# EAGLE design ometer (EAGLE 5.04)
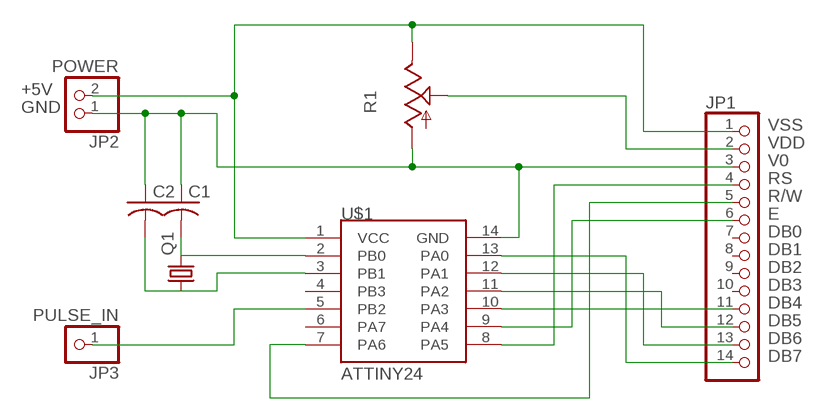
[diagram p0: schematic, sheet 1]

## Parts
C1  C-USC0805K  [C0805K]
C2  C-USC0805K  [C0805K]
JP1  PINHD-1X14  [1X14]
JP2  POWER  PINHD-1X2  [1X02]
JP3  PULSE_IN  PINHD-1X1  [1X01]
Q1  CRYSTALTC26H  [TC26H]
R1  TRIM_US-RJ9W  [RJ9W]
U$1  ATTINY24  [SO14]

## Nets
N$1: JP1.1 JP2.2 R1.E U$1.1(VCC)
N$2: C1.1 C2.1 JP1.3 JP2.1 R1.A U$1.14(GND)
N$3: JP1.2 R1.S
N$4: JP3.1 U$1.5(PB2)
N$5: C1.2 Q1.2 U$1.2(PB0)
N$6: C2.2 Q1.1 U$1.3(PB1)
N$7: JP1.14 U$1.13(PA0)
N$8: JP1.13 U$1.12(PA1)
N$9: JP1.12 U$1.11(PA2)
N$10: JP1.11 U$1.10(PA3)
N$11: JP1.6 U$1.9(PA4)
N$12: JP1.4 U$1.8(PA5)
N$13: JP1.5 U$1.7(PA6)
Unconnected: JP1.7 JP1.8 JP1.9 JP1.10 U$1.4(PB3) U$1.6(PA7)

## Notes on the sheet
- +5V
- GND
- VSS
- VDD
- V0
- RS
- R/W
- E
- DB0
- DB1
- DB2
- DB3
- DB4
- DB5
- DB6
- DB7

## Library data of the parts
C1 C2 = resistor:C-US: CAPACITOR, American symbol
JP1 = pinhead:PINHD-1X14: PIN HEADER
JP2 = pinhead:PINHD-1X2: PIN HEADER
JP3 = pinhead:PINHD-1X1: PIN HEADER
Q1 = crystal:CRYSTAL: CRYSTAL
R1 = pot:TRIM_US-: POTENTIOMETER
U$1 = Needle Lib:ATTINY24

## Board
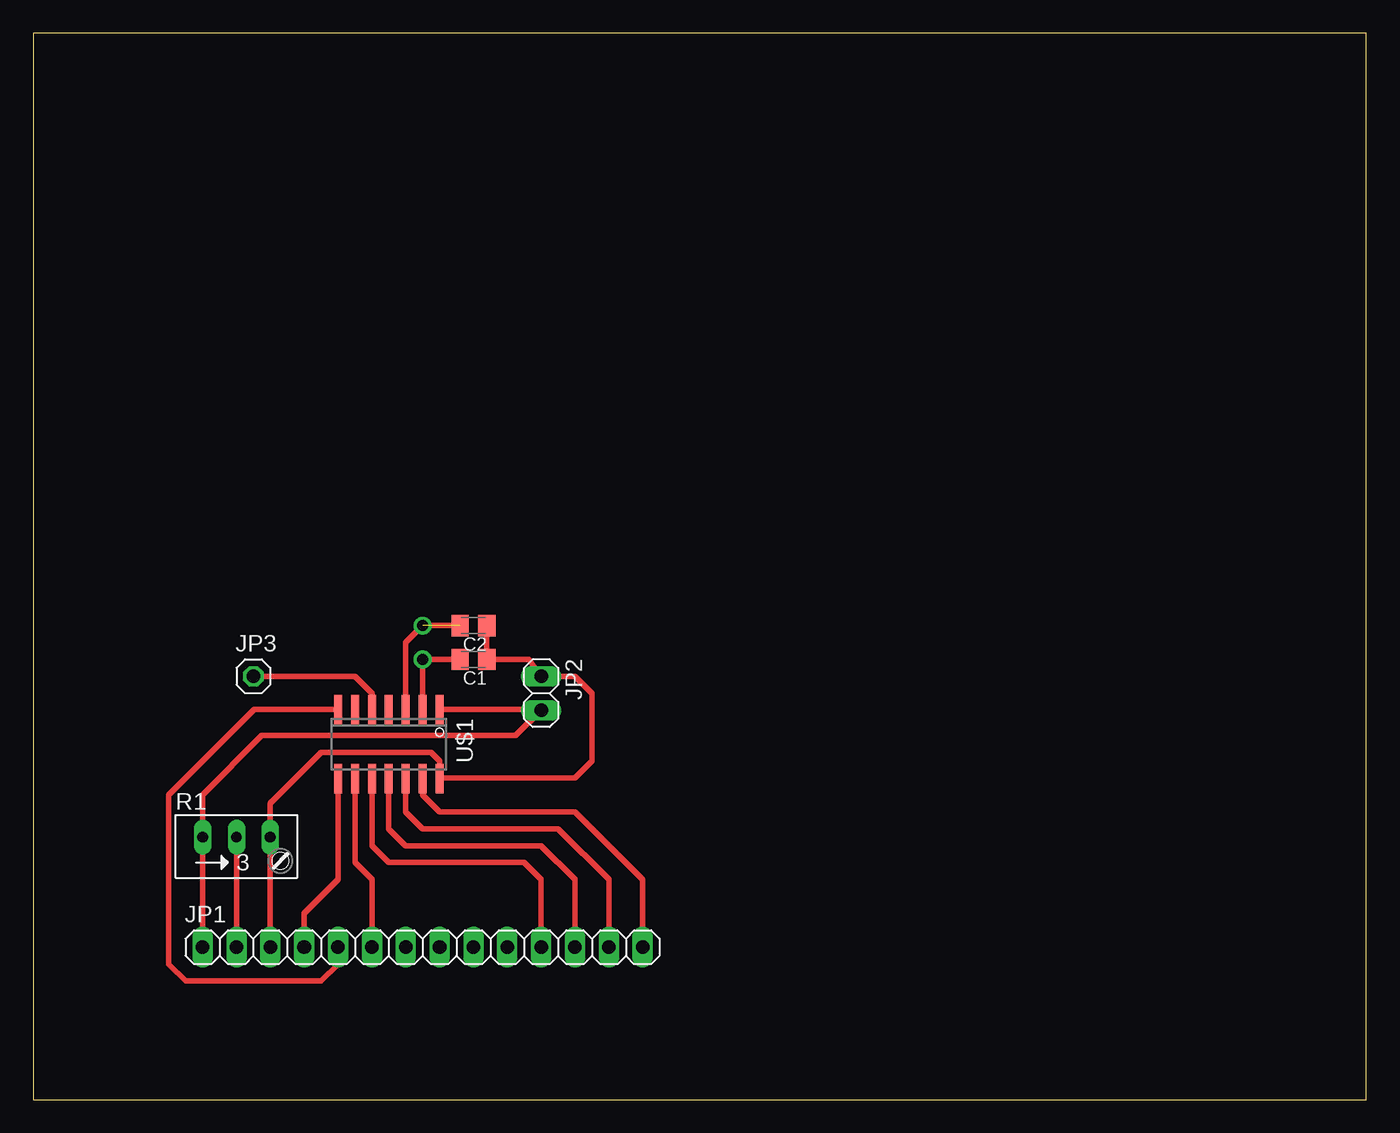
[diagram p1: board, top side]
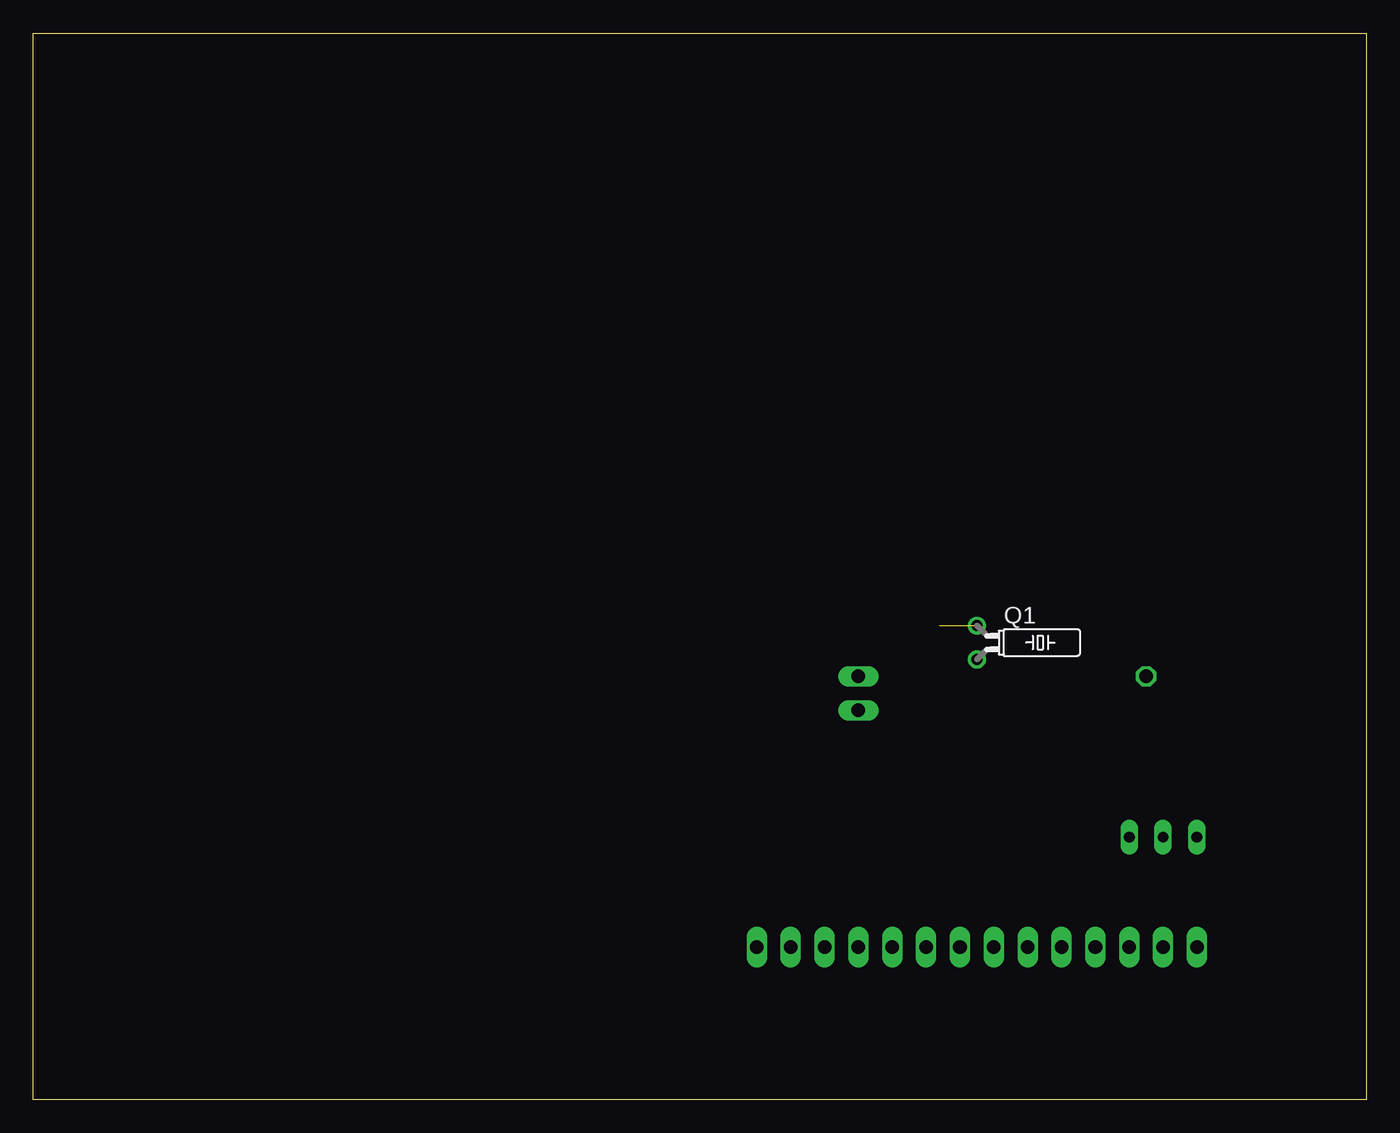
[diagram p2: board, bottom side, seen from below]

Size 100 x 80 mm. Coordinates in mm from the lower left corner, seen from the top.
Outline: 0,0 100,0 100,80 0,80 0,0
Copper layers (1*16): Top 0.035mm / dielectric 1.5mm / Bottom 0.035mm
Design rules "default": minimum track width 10mil, minimum drill 24mil, track to track 8mil, track to pad 8mil, pad to pad 8mil, via to via 8mil, smd to smd 8mil, copper to edge 40mil, drill to drill 8mil, minimum pad ring 10mil, minimum via ring 8mil, stop-mask expansion 4mil, vias tented up to drill 0mil, thermal gap 10mil

### Footprints (pad centres in the part's own frame; a part is rotated, then mirrored left to right if it is on the bottom)
C0805K = smd 1.3 x 1.6: 1 -1,0; 2 1,0
1X14 = drill 1.016 long: 1 -16.51,0; 2 -13.97,0; 3 -11.43,0; 4 -8.89,0; 5 -6.35,0; 6 -3.81,0; 7 -1.27,0; 8 1.27,0; 9 3.81,0; 10 6.35,0; 11 8.89,0; 12 11.43,0; 13 13.97,0; 14 16.51,0
1X02 = drill 1.016 long: 1 -1.27,0; 2 1.27,0
1X01 = drill 1.016 octagon: 1 0,0
TC26H = drill 0.813 round: 1 -1.27,0; 2 1.27,0
RJ9W = drill 0.813 long: A 2.54,0.635; E -2.54,0.635; S 0,0.635
SO14 = smd 0.6 x 2.2: 1 -3.81,-2.6; 2 -2.54,-2.6; 3 -1.27,-2.6; 4 0,-2.6; 5 1.27,-2.6; 6 2.54,-2.6; 7 3.81,-2.6; 8 3.81,2.6; 9 2.54,2.6; 10 1.27,2.6; 11 0,2.6; 12 -1.27,2.6; 13 -2.54,2.6; 14 -3.81,2.6

### Placement (x,y rotation side)
C1  33.02,33.02 180 top
C2  33.02,35.56 180 top
JP1  29.21,11.43 0 top
JP2  38.1,30.48 270 top
JP3  16.51,31.75 0 top
Q1  29.21,34.29 270 bottom
R1  15.24,19.05 0 top
U$1  26.67,26.67 180 top

### Tracks (layer width: path | path; a pad name or v marks a point on that pad's centre or on a via)
N$1
  Top 0.406: U$1.1 38.04,29.27 JP2.2 36.2,27.3 17.14,27.3 12.7,22.86 R1.E JP1.1
N$2
  Top 0.406: C2.1 C1.1 37.2,33.02 JP2.1 40.64,31.75 41.91,30.48 41.91,25.4 40.64,24.13 30.54,24.13 U$1.14 30.48,25.4 29.84,26.04 21.59,26.04 17.78,22.23 R1.A JP1.3 17.78,10.16
N$3
  Top 0.406: R1.S JP1.2
N$4
  Top 0.406: JP3.1 24.13,31.75 25.4,30.48 U$1.5
N$5
  Top 0.406: C1.2 Q1.2 U$1.2
N$6  (1 unrouted)
  Top 0.406: C2.2 Q1.1 27.94,34.29 U$1.3
N$7
  Top 0.406: U$1.13 29.21,22.86 30.48,21.59 40.64,21.59 45.72,16.51 JP1.14
N$8
  Top 0.406: JP1.13 43.18,16.51 39.37,20.32 29.21,20.32 27.94,21.59 U$1.12
N$9
  Top 0.406: JP1.12 40.64,16.51 38.1,19.05 27.94,19.05 26.67,20.32 U$1.11
N$10
  Top 0.406: JP1.11 38.1,16.51 36.83,17.78 26.67,17.78 25.4,19.05 U$1.10
N$11
  Top 0.406: JP1.6 25.4,16.51 24.13,17.78 U$1.9
N$12
  Top 0.406: JP1.4 20.32,13.97 22.86,16.51 U$1.8
N$13
  Top 0.406: U$1.7 16.57,29.27 10.16,22.86 10.16,10.16 11.43,8.89 21.59,8.89 22.86,10.16 JP1.5